# Altium project AdaptWingPower.PrjPcb
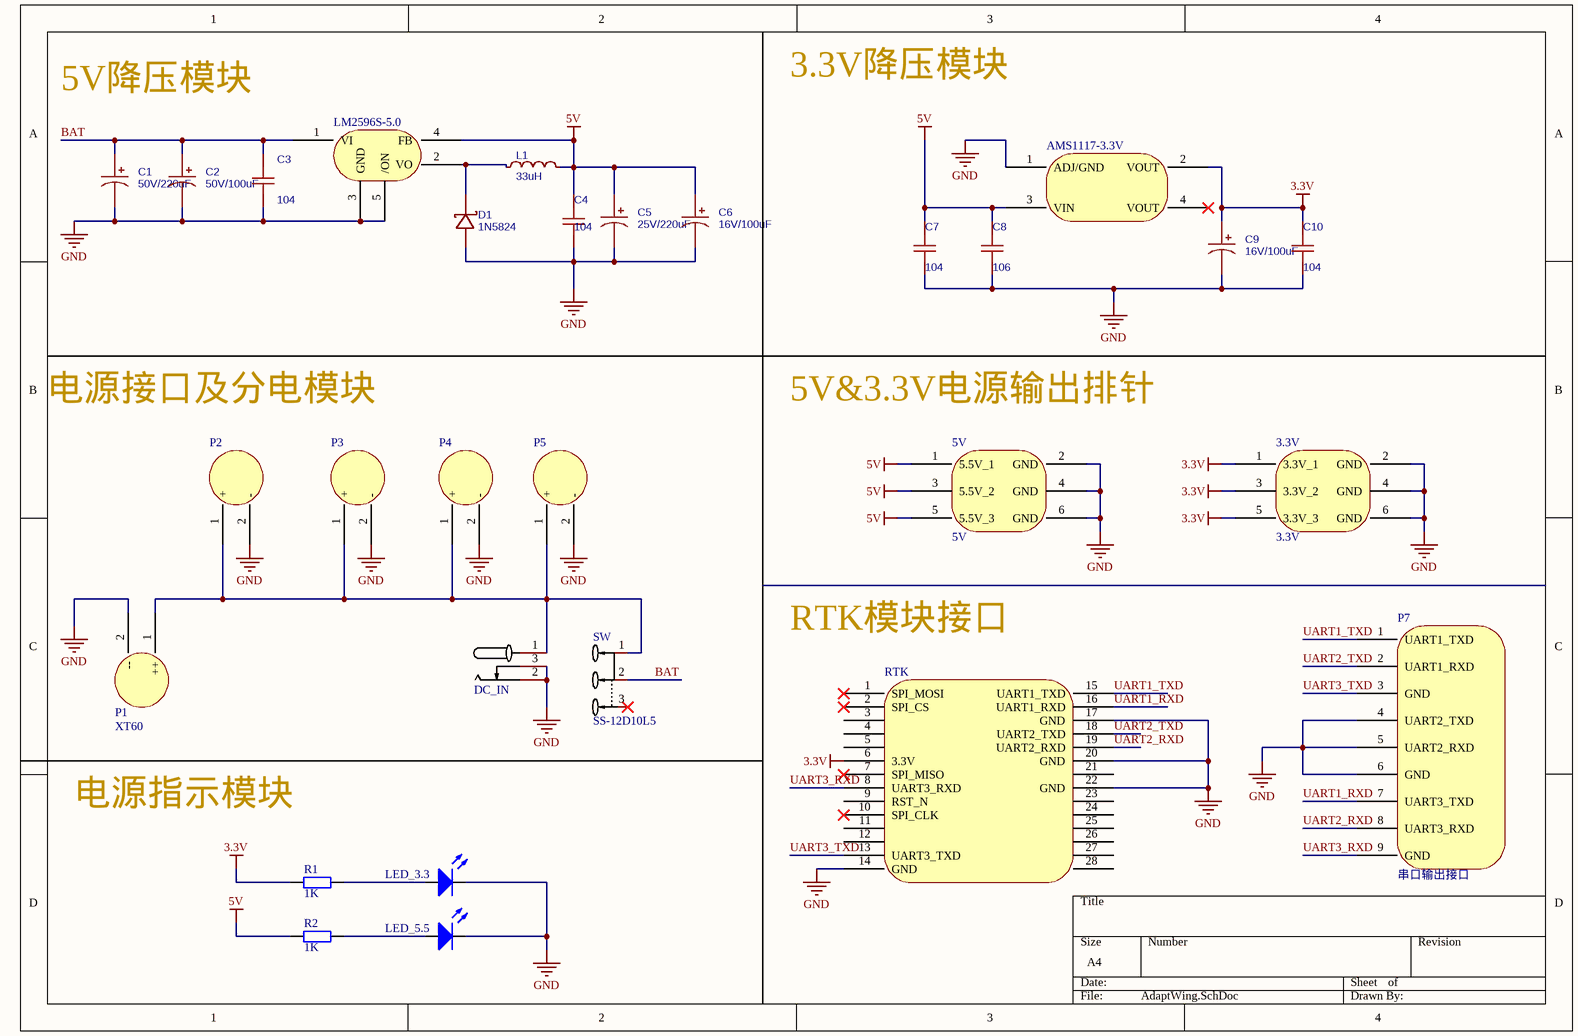
[diagram p0: AdaptWing.SchDoc]
1 sheet, 29 parts. Net scope: global (net labels, ports and power ports of the same name join across sheets).
Board file: AdaptWing.PcbDoc

## Sheet AdaptWing.SchDoc
size A4; SheetNumber: 1; SheetTotal: 1

### Parts
3.3V  3.3V  [HDR-TH_6P-P2.54-V-M-R2-C3-S2.54-1]
5V  5V  [HDR-TH_6P-P2.54-V-M-R2-C3-S2.54-1]
AMS1117-3.3V  AMS1117-3.3V  [SOT-223-4_L6.5-W3.5-P2.30-LS7.0-BR]  (value not drawn)
C1  50V/220uF  [CAP-SMD_BD8.0-L8.3-W8.3-FD]
C2  50V/100uF  [CAP-SMD_BD8.0-L8.3-W8.3-FD]
C3  104  [C0603]
C4  104  [C0603]
C5  25V/220uF  [CAP-SMD_BD6.3-L6.6-W6.6-LS7.4-FD]
C6  16V/100uF  [CAP-SMD_BD6.3-L6.6-W6.6-FD]
C7  104  [C0603]
C8  106  [C0603]
C9  16V/100uF  [CAP-SMD_BD6.3-L6.6-W6.6-FD]
C10  104  [C0603]
D1  1N5824  [1N5824]
DC_IN  DC插座  [DC-IN-TH_DC-044-BXXX]  (value not drawn)
L1  33uH  [1040电感]
LED_3.3  LED_3.3  [0603_LED]  (value not drawn)
LED_5.5  LED_5.5  [0603_LED]  (value not drawn)
LM2596S-5.0  LM2596S-5.0  [TO263-5A]  (value not drawn)
P1  XT60  [分电焊盘]
P2  分电焊盘  [分电焊盘]  (value not drawn)
P3  分电焊盘  [分电焊盘]  (value not drawn)
P4  分电焊盘  [分电焊盘]  (value not drawn)
P5  分电焊盘  [分电焊盘]  (value not drawn)
P7  串口输出接口  [2.54mm-3×3p]
R1  1K  [0603C]
R2  1K  [0603C]
RTK  排母2.0mm  [2mm-28pins]  (value not drawn)
SW  SS-12D10L5  [SW-TH_SS-12D10L5]

### Nets
3.3V: 3.3V.1(3.3V_1) 3.3V.3(3.3V_2) 3.3V.5(3.3V_3) AMS1117-3.3V.2(VOUT) C9.1 C10.2 R1.1 RTK.6(3.3V)
5V: 5V.1(5.5V_1) 5V.3(5.5V_2) 5V.5(5.5V_3) AMS1117-3.3V.3(VIN) C4.2 C5.1 C6.1 C7.2 C8.2 L1.2 LM2596S-5.0.4(FB) R2.1
GND: 3.3V.2(GND) 3.3V.4(GND) 3.3V.6(GND) 5V.2(GND) 5V.4(GND) 5V.6(GND) AMS1117-3.3V.1(ADJ/GND) C1.2 C2.2 C3.1 C4.1 C5.2 C6.2 C7.1 C8.1 C9.2 C10.1 D1.2(A) DC_IN.2(GND) DC_IN.3(GND) LED_3.3.2(K) LED_5.5.2(K) LM2596S-5.0.3(GND) LM2596S-5.0.5(/ON) P1.2(--) P2.2(-) P3.2(-) P4.2(-) P5.2(-) P7.4(UART2_TXD) P7.5(UART2_RXD) P7.6(GND) RTK.14(GND) RTK.17(GND) RTK.20(GND) RTK.22(GND)
BAT: C1.1 C2.1 C3.2 LM2596S-5.0.1(VI) SW.2
UART1_RXD: P7.7(UART3_TXD) RTK.16(UART1_RXD)
UART1_TXD: P7.1(UART1_TXD) RTK.15(UART1_TXD)
UART2_RXD: P7.8(UART3_RXD) RTK.19(UART2_RXD)
UART2_TXD: P7.2(UART1_RXD) RTK.18(UART2_TXD)
UART3_RXD: P7.9(GND) RTK.8(UART3_RXD)
UART3_TXD: P7.3(GND) RTK.13(UART3_TXD)
NetD1_1: D1.1(C) L1.1 LM2596S-5.0.2(VO)
NetDC_IN_1: DC_IN.1(pwr) P1.1(++) P2.1(+) P3.1(+) P4.1(+) P5.1(+) SW.1
NetLED_3.3_1: LED_3.3.1(A) R1.2
NetLED_5.5_1: LED_5.5.1(A) R2.2

Not connected (* = marked no-connect by the designer): AMS1117-3.3V 4(VOUT)*; RTK 1(SPI_MOSI)* 2(SPI_CS)* 3 4 5 7(SPI_MISO)* 9(RST_N) 10(SPI_CLK)* 11 12 21 23 24 25 26 27 28; SW 3*

### Notes on the sheet
- 5V降压模块
- 3.3V降压模块
- 电源接口及分电模块
- 5V&3.3V电源输出排针
- RTK模块接口
- 电源指示模块

### Library data of the parts
AMS1117-3.3V = AMS1117-3.3V: 3.3V稳压芯片
C1 = 50V/220uF: BOM_Manufacturer: Yunxing; BOM_Manufacturer Part: ECG1KM470F14OTBO; nameAlias: Capacitance; Contributor: LCSC; BOM_Supplier: LCSC; BOM_Supplier Part: C525429; spicePre: C; spiceSymbolName: ECG1KM470F14OTBO COPY
C2 = 50V/100uF: BOM_Manufacturer: Yunxing; BOM_Manufacturer Part: ECG1KM470F14OTBO; nameAlias: Capacitance; Contributor: LCSC; BOM_Supplier: LCSC; BOM_Supplier Part: C525429; spicePre: C; spiceSymbolName: ECG1KM470F14OTBO COPY
C3 C4 C7 C10 = 104: nameAlias: Value(F); Contributor: LCEDA_Lib; spicePre: C; spiceSymbolName: C_0603_US
C5 = 25V/220uF: BOM_Manufacturer: Yunxing; BOM_Manufacturer Part: ECG1KM470F14OTBO; nameAlias: Capacitance; Contributor: LCSC; BOM_Supplier: LCSC; BOM_Supplier Part: C525429; spicePre: C; spiceSymbolName: ECG1KM470F14OTBO COPY
C6 C9 = 16V/100uF: 电解电容; BOM_Manufacturer: Yunxing; BOM_Manufacturer Part: ECG1KM470F14OTBO; nameAlias: Capacitance; Contributor: LCSC; BOM_Supplier: LCSC; BOM_Supplier Part: C525429; spicePre: C; spiceSymbolName: ECG1KM470F14OTBO COPY
C8 = 106: nameAlias: Value(F); Contributor: LCEDA_Lib; spicePre: C; spiceSymbolName: C_0603_US
D1 = 1N5824: Contributor: xuncikulv; BOM_Supplier: lynxfoor; spicePre: D; spiceSymbolName: 1N5824贴片
L1 = 33uH: BOM_Manufacturer: MAZO; BOM_Manufacturer Part: MPCA-0630-1R0-M; nameAlias: Inductance; Contributor: liuliubilc; BOM_Supplier: LCSC; BOM_Supplier Part: C268399; BOM_JLCPCB Part Class: Extended Part; spicePre: L; spiceSymbolName: 0630-1R0电感
LED_3.3 = LED_3.3: LED_3.3，使用绿色LED
LED_5.5 = LED_5.5: LED_5.5，使用蓝色LED
LM2596S-5.0 = LM2596S-5.0: 5V稳压
P1 = XT60: 航模电池接口
P2-P5 = PWR_DIV
P7 = 2.54mm-3×3p
R1 R2 = 1K: Resistor; Published: 8-Jun-2000; LatestRevisionDate: 17-Jul-2002; LatestRevisionNote: Re-released for DXP Platform.; PackageReference: AXIAL-0.4; Publisher: Altium Limited; PackageDescription: Axial Device, Thru-Hole; 2 Leads; 0.4 in Pin Spacing; Value: 1K
SW = SS-12D10L5: 两档滑动开关; Manufacturer: XKB Connectivity(中国星坤); Add into BOM: yes; Current Rating (DC): 3A; Voltage Rating (DC): 125V; Circuit: 单刀双掷; Mechanical Life: 1万次; Actuator Color: 黑色; Actuator Style: 矩形柱状; Pin Style: PC引脚; Switch Length: 13mm; Switch Width: 6.8mm; Switch Height: 6.4mm; Symbol: SS-12D10L5; Device: SS-12D10L5; LCSC Part Name: 柄长5mm 直插双档 滑动开关 大电流; Supplier Part: C319012; Manufacturer Part: SS-12D10L5; Supplier Footprint: 插件; JLCPCB Part Class: 扩展库; Datasheet: https://atta.szlcsc.com/upload/public/pdf/source/20211009/D6412F37AABE6F9459A6EE7FA4DAEADB.pdf; Supplier: LCSC; Convert to PCB: yes; Current Rating (AC): 3A; Voltage Rating (AC): 125V; Mounting Style: 直插; Operating Temperature: -40℃~+85℃; Name: SS-12D10L5